# EasyEDA schematic neonred-coded-update-2026-10-06.json
TITLE: NEONRED; REV: 1.0; Date: 2026-10-04; Sheet: 1/1; Drawn By: matthieu3241; Company: Your Company
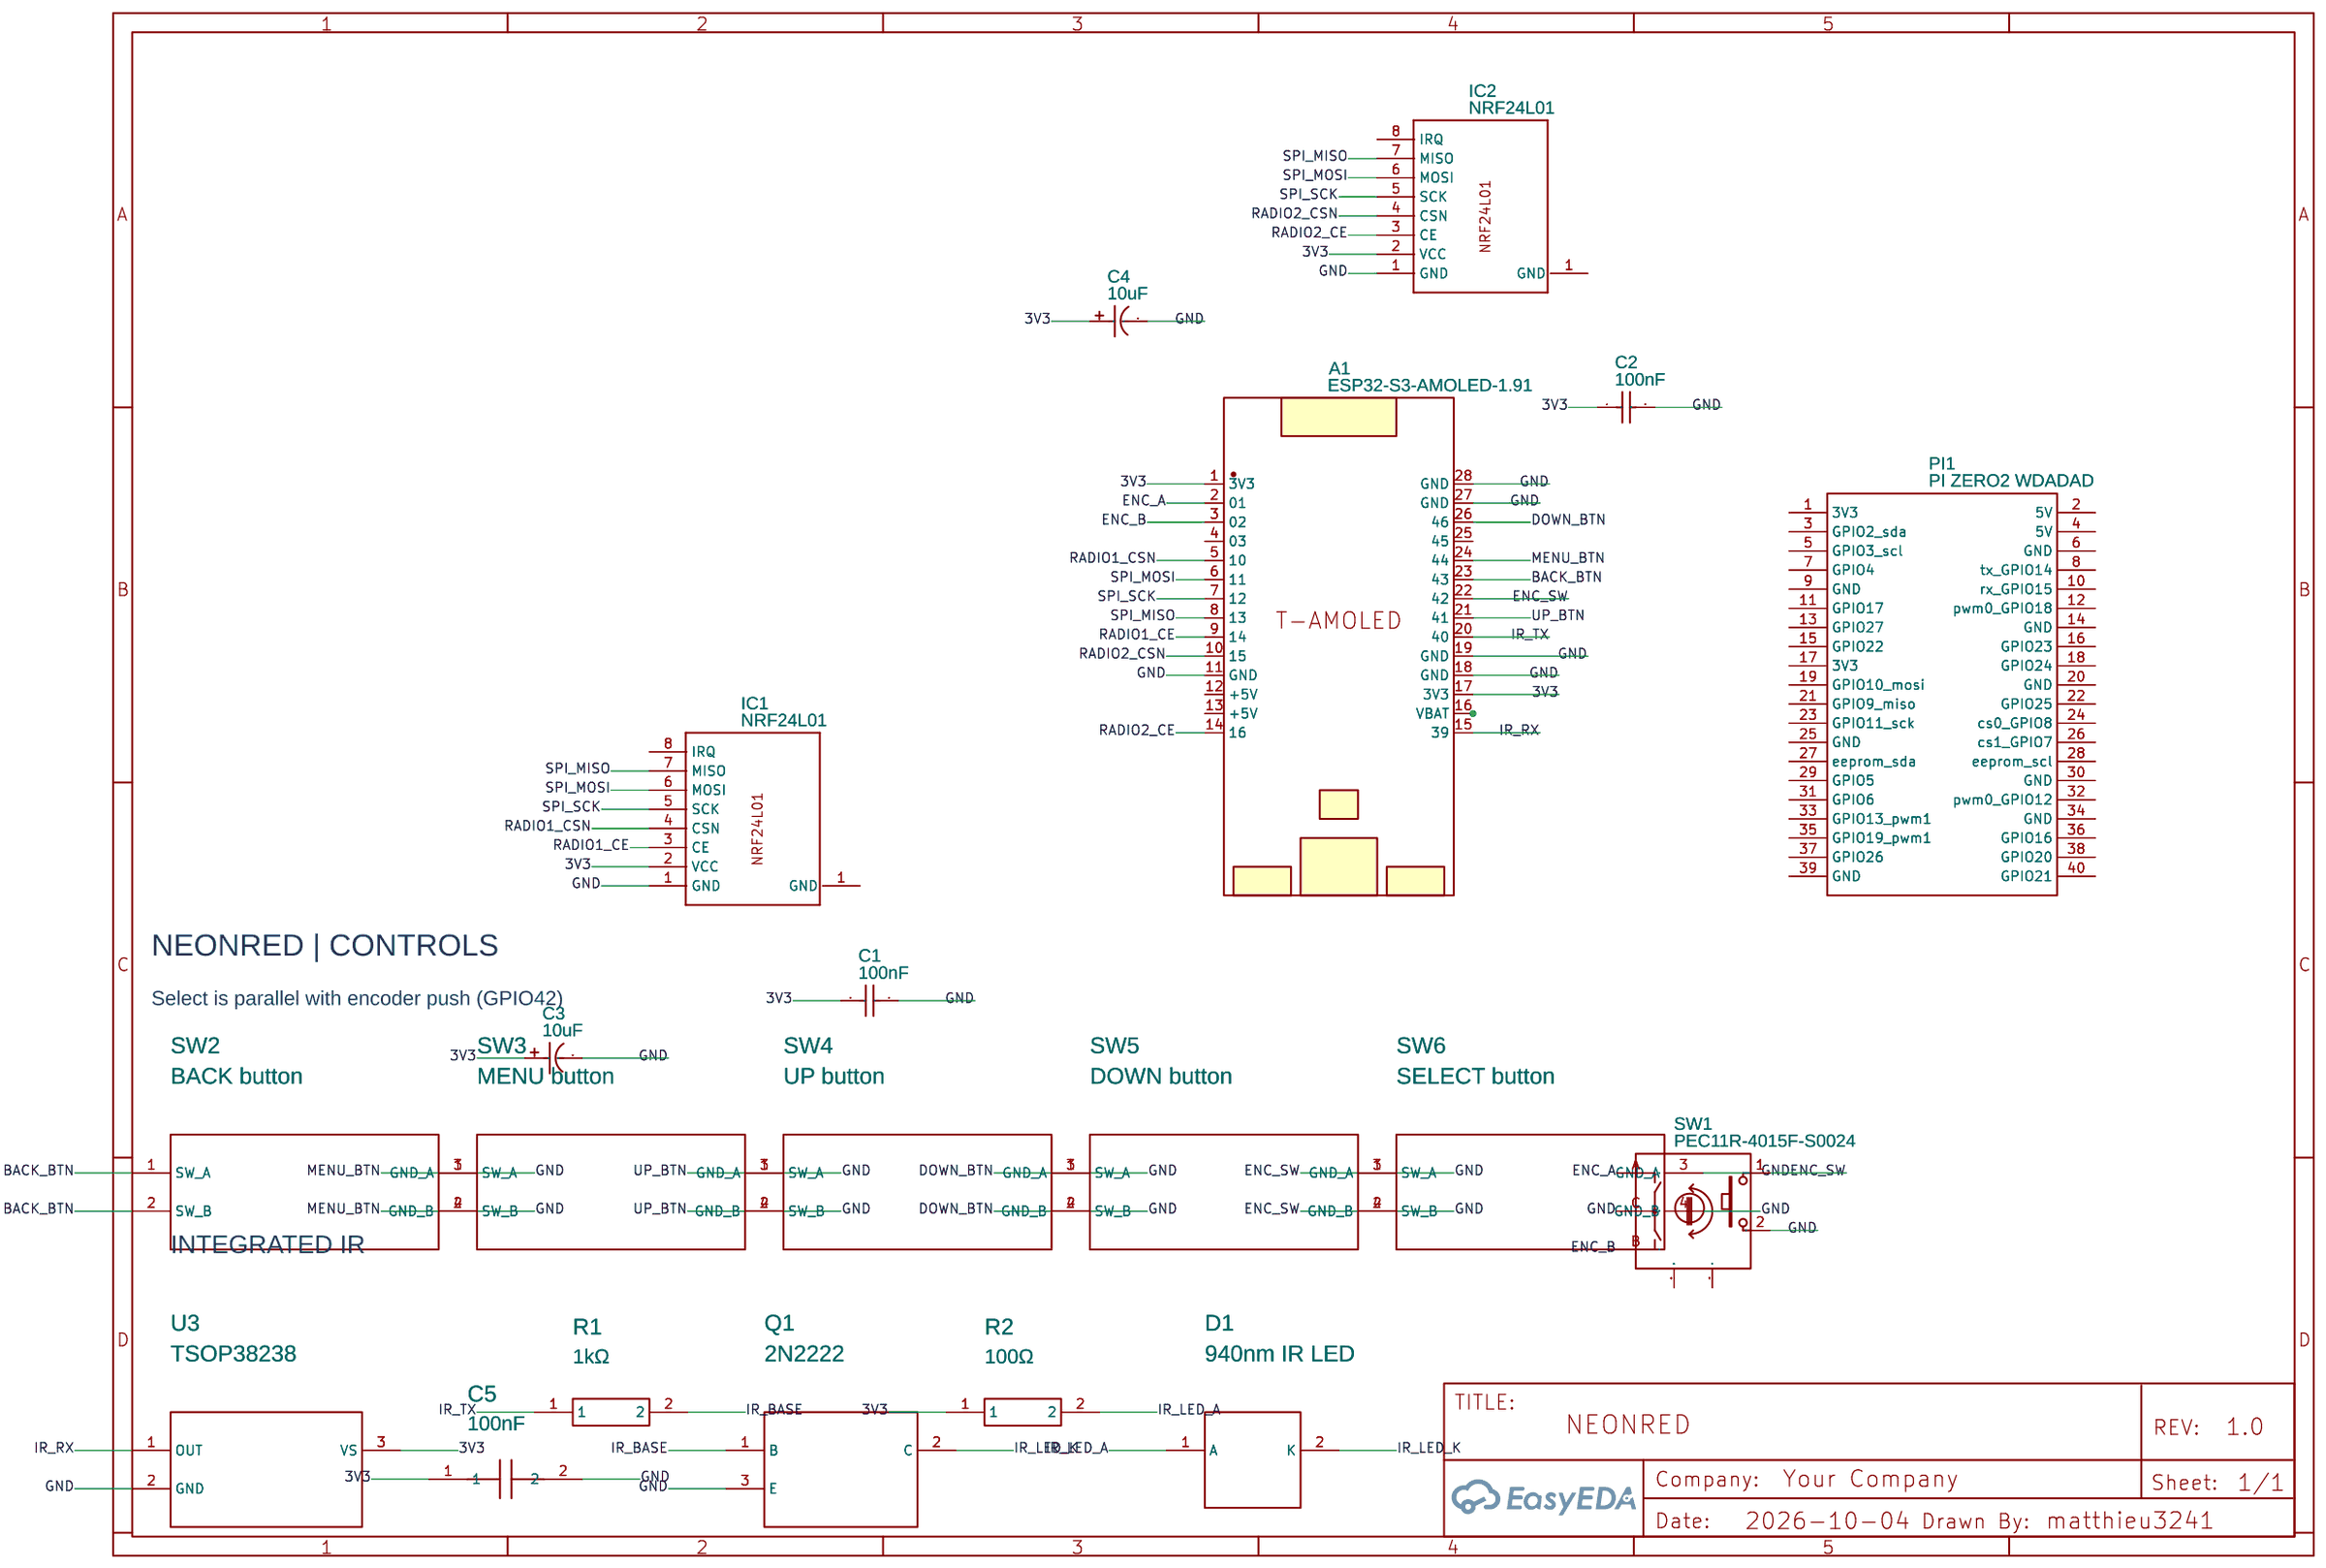
[diagram p0: schematic sheet]

## Parts
A1  ESP32-S3-AMOLED-1.91  [T-DISPLAY S3 AMOLED]
C1  100nF  [CAP-TH_L4.9-W3.7-P5.08-D0.5]
C2  100nF  [CAP-TH_L4.9-W3.7-P5.08-D0.5]
C3  10uF  [CAPACITOR 10UF TH FP]
C4  10uF  [CAPACITOR 10UF TH FP]
C5  100nF  [CAP-TH_L4.9-W3.7-P5.08-D0.5]
D1  940nm IR LED  [LED-5MM]
IC1  NRF24L01  [NRF24L01]
IC2  NRF24L01  [NRF24L01]
PI1  PI ZERO2 WDADAD  [RASPBERRY-PIZERO-W]
Q1  2N2222  [TO-92(TO-92-3)]
R1  1kΩ  [AXIAL-0.3]
R2  100Ω  [AXIAL-0.3]
SW1  PEC11R-4015F-S0024  [SW-TH_PEC11R-4XXXF-SXXXX]
SW2  BACK button  [SW-TH_4P-L6.0-W6.0-P4.50-LS6.5]
SW3  MENU button  [SW-TH_4P-L6.0-W6.0-P4.50-LS6.5]
SW4  UP button  [SW-TH_4P-L6.0-W6.0-P4.50-LS6.5]
SW5  DOWN button  [SW-TH_4P-L6.0-W6.0-P4.50-LS6.5]
SW6  SELECT button  [SW-TH_4P-L6.0-W6.0-P4.50-LS6.5]
U3  TSOP38238  [TSOP38238_RA]

## Library data of the parts
A1 = ESP32-S3-AMOLED-1.91: Manufacturer: Lilygo; Manufacturer Part: T-Display S3 AMOLED; Supplier: Lilygo; link: https://www.lilygo.cc/products/t-display-s3-amoled; Contributor: adamzh
C1 C2 = 100nF: Supplier: LCSC; Manufacturer: null; Manufacturer Part: 0.1UF(104) +-20% 63v; Supplier Part: C19355; JLCPCB Part Class: Extended Part
C3 C4 = Capacitor 10uF TH: Contributor: airyrahman
C5 = 100nF: Manufacturer Part: 100nF ceramic THT; Footprint Status: DRAFT - VERIFY BEFORE FAB
D1 = 940nm IR LED: Manufacturer Part: 940nm IR LED, 5 mm THT; Footprint Status: DRAFT - VERIFY BEFORE FAB
IC1 IC2 = NRF24L01: Contributor: JoachimHugo1
PI1 = PI ZERO2 WDADAD: Contributor: greg_dickson
Q1 = 2N2222: Manufacturer Part: 2N2222A; Footprint Status: DRAFT - VERIFY BEFORE FAB
R1 = 1kΩ: Manufacturer Part: 1k axial THT; Footprint Status: DRAFT - VERIFY BEFORE FAB
R2 = 100Ω: Manufacturer Part: 100Ω axial THT; Footprint Status: DRAFT - VERIFY BEFORE FAB
SW1 = PEC11R-4015F-S0024: Contributor: LCSC; Supplier: LCSC; Supplier Part: C143789; Manufacturer: BOURNS; JLCPCB Part Class: Extended Part
SW2 = BACK button: Manufacturer Part: 6x6mm THT tactile switch, NO; Footprint Status: DRAFT - VERIFY BEFORE FAB
SW3 = MENU button: Manufacturer Part: 6x6mm THT tactile switch, NO; Footprint Status: DRAFT - VERIFY BEFORE FAB
SW4 = UP button: Manufacturer Part: 6x6mm THT tactile switch, NO; Footprint Status: DRAFT - VERIFY BEFORE FAB
SW5 = DOWN button: Manufacturer Part: 6x6mm THT tactile switch, NO; Footprint Status: DRAFT - VERIFY BEFORE FAB
SW6 = SELECT button: Manufacturer Part: 6x6mm THT tactile switch, NO; Footprint Status: DRAFT - VERIFY BEFORE FAB
U3 = TSOP38238: Footprint Status: DRAFT - VERIFY BEFORE FAB

## Nets
3V3: A1.1(3V3) A1.17(3V3) C1.1 C2.1 C3.1 C4.1 C5.1 IC1.2(VCC) IC2.2(VCC) R2.1 U3.3(VS)
GND: A1.11(GND) A1.18(GND) A1.19(GND) A1.27(GND) A1.28(GND) C1.2 C2.2 C3.2 C4.2 C5.2 IC1.1(GND) IC2.1(GND) Q1.3(E) SW1.2 SW1.C SW2.3(GND_A) SW2.4(GND_B) SW3.3(GND_A) SW3.4(GND_B) SW4.3(GND_A) SW4.4(GND_B) SW5.3(GND_A) SW5.4(GND_B) SW6.3(GND_A) SW6.4(GND_B) U3.2(GND)
BACK_BTN: A1.23(43) SW2.1(SW_A) SW2.2(SW_B)
DOWN_BTN: A1.26(46) SW5.1(SW_A) SW5.2(SW_B)
ENC_A: A1.2(01) SW1.A
ENC_B: A1.3(02) SW1.B
ENC_SW: A1.22(42) SW1.1 SW6.1(SW_A) SW6.2(SW_B)
IR_BASE: Q1.1(B) R1.2
IR_LED_A: D1.1(A) R2.2
IR_LED_K: D1.2(K) Q1.2(C)
IR_RX: A1.15(39) U3.1(OUT)
IR_TX: A1.20(40) R1.1
MENU_BTN: A1.24(44) SW3.1(SW_A) SW3.2(SW_B)
RADIO1_CE: A1.9(14) IC1.3(CE)
RADIO1_CSN: A1.5(10) IC1.4(CSN)
RADIO2_CE: A1.14(16) IC2.3(CE)
RADIO2_CSN: A1.10(15) IC2.4(CSN)
SPI_MISO: A1.8(13) IC1.7(MISO) IC2.7(MISO)
SPI_MOSI: A1.6(11) IC1.6(MOSI) IC2.6(MOSI)
SPI_SCK: A1.7(12) IC1.5(SCK) IC2.5(SCK)
UP_BTN: A1.21(41) SW4.1(SW_A) SW4.2(SW_B)

Not connected (* = marked no-connect by the designer): A1 4(03) 12(+5V) 13(+5V) 16(VBAT) 25(45); IC1 8(IRQ); IC2 8(IRQ); PI1 1(3V3) 2(5V) 3(GPIO2 sda) 4(5V) 5(GPIO3 scl) 6(GND) 7(GPIO4) 8(tx GPIO14) 9(GND) 10(rx GPIO15) 11(GPIO17) 12(pwm0 GPIO18) 13(GPIO27) 14(GND) 15(GPIO22) 16(GPIO23) 17(3V3) 18(GPIO24) 19(GPIO10 mosi) 20(GND) 21(GPIO9 miso) 22(GPIO25) 23(GPIO11 sck) 24(cs0 GPIO8) 25(GND) 26(cs1 GPIO7) 27(eeprom sda) 28(eeprom scl) 29(GPIO5) 30(GND) 31(GPIO6) 32(pwm0 GPIO12) 33(GPIO13 pwm1) 34(GND) 35(GPIO19 pwm1) 36(GPIO16) 37(GPIO26) 38(GPIO20) 39(GND) 40(GPIO21); SW1 MT1 MT2

## Notes on the sheet
- NEONRED | CONTROLS
- Select is parallel with encoder push (GPIO42)
- INTEGRATED IR
